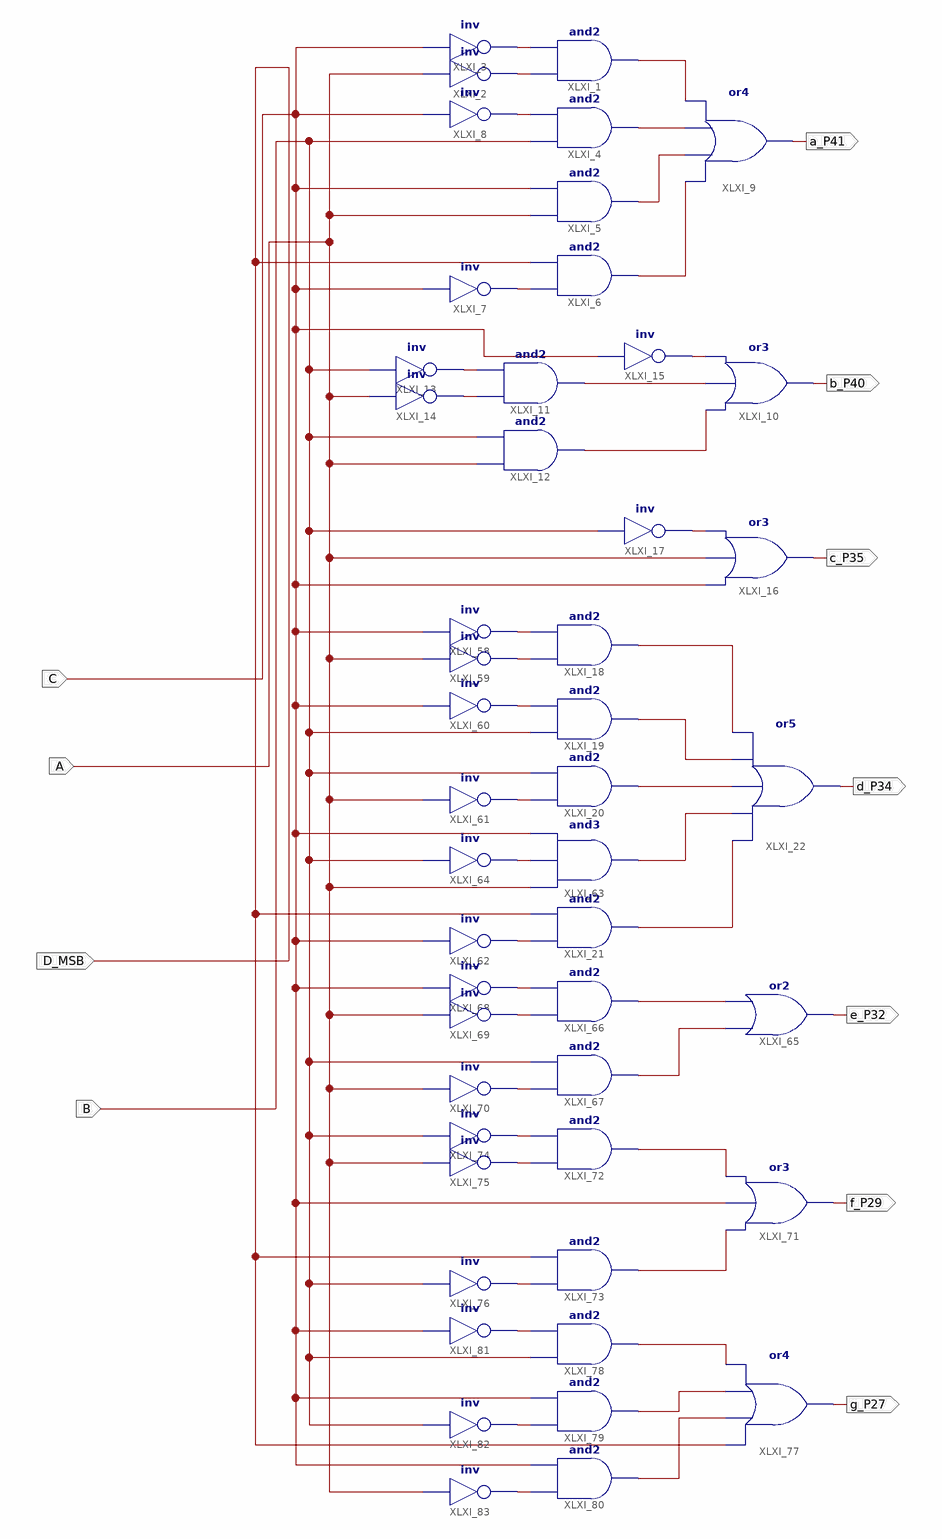
[diagram p0: schematic sheet 1]
// Xilinx ISE schematic segment_lab5.sch (spartan6) as structural Verilog: 48 symbols, 11 ports
module segment_lab5 (
  input  A,
  input  B,
  input  C,
  input  D_MSB,
  output a_P41,
  output b_P40,
  output c_P35,
  output d_P34,
  output e_P32,
  output f_P29,
  output g_P27
);

  wire XLXN_1, XLXN_2, XLXN_3, XLXN_4, XLXN_5, XLXN_6, XLXN_7, XLXN_8, XLXN_11, XLXN_12, XLXN_13, XLXN_14,
       XLXN_15, XLXN_17, XLXN_19, XLXN_20, XLXN_21, XLXN_22, XLXN_67, XLXN_68, XLXN_69, XLXN_70, XLXN_71,
       XLXN_72, XLXN_73, XLXN_86, XLXN_87, XLXN_88, XLXN_89, XLXN_90, XLXN_96, XLXN_97, XLXN_98, XLXN_99,
       XLXN_100, XLXN_107, XLXN_108, XLXN_109, XLXN_111, XLXN_112, XLXN_113;

  and XLXI_1 (XLXN_5, XLXN_1, XLXN_2);
  not XLXI_2 (XLXN_1, A);
  not XLXI_3 (XLXN_2, C);
  and XLXI_4 (XLXN_6, B, XLXN_4);
  and XLXI_5 (XLXN_7, A, C);
  and XLXI_6 (XLXN_8, XLXN_3, D_MSB);
  not XLXI_7 (XLXN_3, C);
  not XLXI_8 (XLXN_4, C);
  or XLXI_9 (a_P41, XLXN_8, XLXN_7, XLXN_6, XLXN_5);
  or XLXI_10 (b_P40, XLXN_15, XLXN_14, XLXN_13);
  and XLXI_11 (XLXN_14, XLXN_12, XLXN_11);
  and XLXI_12 (XLXN_15, A, B);
  not XLXI_13 (XLXN_11, B);
  not XLXI_14 (XLXN_12, A);
  not XLXI_15 (XLXN_13, C);
  or XLXI_16 (c_P35, C, A, XLXN_17);
  not XLXI_17 (XLXN_17, B);
  and XLXI_18 (XLXN_21, XLXN_69, XLXN_68);
  and XLXI_19 (XLXN_20, B, XLXN_70);
  and XLXI_20 (XLXN_19, XLXN_71, B);
  and XLXI_21 (XLXN_67, XLXN_72, D_MSB);
  or XLXI_22 (d_P34, XLXN_67, XLXN_22, XLXN_19, XLXN_20, XLXN_21);
  not XLXI_58 (XLXN_68, C);
  not XLXI_59 (XLXN_69, A);
  not XLXI_60 (XLXN_70, C);
  not XLXI_61 (XLXN_71, A);
  not XLXI_62 (XLXN_72, C);
  and XLXI_63 (XLXN_22, A, XLXN_73, C);
  not XLXI_64 (XLXN_73, B);
  or XLXI_65 (e_P32, XLXN_90, XLXN_89);
  and XLXI_66 (XLXN_89, XLXN_87, XLXN_86);
  and XLXI_67 (XLXN_90, XLXN_88, B);
  not XLXI_68 (XLXN_86, C);
  not XLXI_69 (XLXN_87, A);
  not XLXI_70 (XLXN_88, A);
  and XLXI_73 (XLXN_100, XLXN_98, D_MSB);
  and XLXI_72 (XLXN_99, XLXN_97, XLXN_96);
  or XLXI_71 (f_P29, XLXN_100, C, XLXN_99);
  not XLXI_74 (XLXN_96, B);
  not XLXI_75 (XLXN_97, A);
  not XLXI_76 (XLXN_98, B);
  and XLXI_78 (XLXN_107, B, XLXN_111);
  and XLXI_79 (XLXN_108, XLXN_112, C);
  and XLXI_80 (XLXN_109, XLXN_113, C);
  not XLXI_81 (XLXN_111, C);
  not XLXI_82 (XLXN_112, B);
  not XLXI_83 (XLXN_113, A);
  or XLXI_77 (g_P27, D_MSB, XLXN_109, XLXN_108, XLXN_107);
endmodule
